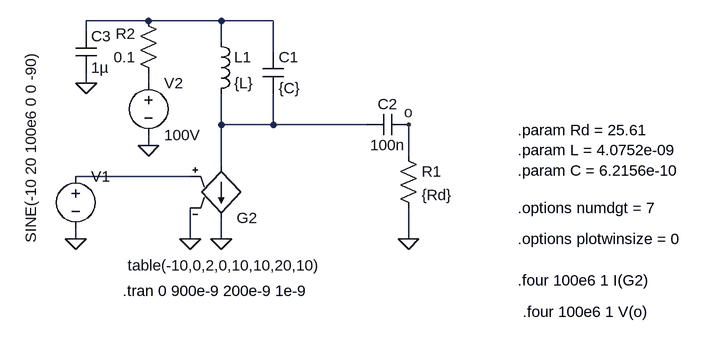
[diagram p0: schematic eje_clase_c_AM.asc]
eje_clase_c_AM.asc, the LTspice schematic file:
Version 4
SHEET 1 880 680
WIRE -256 -96 -352 -96
WIRE -144 -96 -256 -96
WIRE -64 -96 -144 -96
WIRE -352 -80 -352 -96
WIRE -144 -64 -144 -96
WIRE -64 -48 -64 -96
WIRE -352 0 -352 -16
WIRE -256 0 -256 -16
WIRE -144 64 -144 16
WIRE -64 64 -64 16
WIRE -64 64 -144 64
WIRE 80 64 -64 64
WIRE -256 96 -256 80
WIRE 144 112 144 64
WIRE -144 128 -144 64
WIRE -192 144 -368 144
WIRE -368 240 -368 224
WIRE -192 240 -192 192
WIRE -144 240 -144 208
WIRE 144 240 144 192
FLAG -144 240 0
FLAG 144 240 0
FLAG -192 240 0
FLAG -368 240 0
FLAG -256 96 0
FLAG 144 64 o
FLAG -352 0 0
SYMBOL voltage -368 128 R0
WINDOW 3 -69 118 VLeft 2
WINDOW 123 0 0 Left 2
WINDOW 39 0 0 Left 2
SYMATTR Value SINE(-10 20 100e6 0 0 -90)
SYMATTR InstName V1
SYMBOL ind -160 -80 R0
SYMATTR InstName L1
SYMATTR Value {L}
SYMBOL cap -80 -48 R0
SYMATTR InstName C1
SYMATTR Value {C}
SYMBOL cap 144 48 R90
WINDOW 0 0 32 VBottom 2
WINDOW 3 32 32 VTop 2
SYMATTR InstName C2
SYMATTR Value 100n
SYMBOL voltage -256 -16 R0
WINDOW 123 0 0 Left 2
WINDOW 39 0 0 Left 2
SYMATTR InstName V2
SYMATTR Value 100V
SYMBOL res 128 96 R0
SYMATTR InstName R1
SYMATTR Value {Rd}
SYMBOL g2 -144 224 M180
WINDOW 3 -144 -57 Left 2
SYMATTR Value table(-10,0,2,0,10,10,20,10)
SYMATTR InstName G2
SYMBOL cap -368 -80 R0
SYMATTR InstName C3
SYMATTR Value 1µ
SYMBOL res -240 0 R180
WINDOW 0 36 76 Left 2
WINDOW 3 36 40 Left 2
SYMATTR InstName R2
SYMATTR Value 0.1
TEXT -296 320 Left 2 !.tran 0 900e-9 200e-9 1e-9
TEXT 312 72 Left 2 !.param Rd = 25.61\n.param L = 4.0752e-09\n.param C = 6.2156e-10
TEXT 312 192 Left 2 !.options numdgt = 7
TEXT 312 240 Left 2 !.options plotwinsize = 0
TEXT 312 304 Left 2 !.four 100e6 1 I(G2)
TEXT 320 352 Left 2 !.four 100e6 1 V(o)

The netlist it stands for:
* eje_clase_c_AM.asc
V1 N004 0 SINE(-10 20 100e6 0 0 -90)
L1 N001 N003 {L}
C1 N001 N003 {C}
C2 o N003 100n
V2 N002 0 100V
R1 o 0 {Rd}
G2 N003 0 N004 0 table(-10,0,2,0,10,10,20,10)
C3 N001 0 1µ
R2 N002 N001 0.1
.tran 0 900e-9 200e-9 1e-9
.param Rd = 25.61
.param L = 4.0752e-09
.param C = 6.2156e-10
.options numdgt = 7
.options plotwinsize = 0
.four 100e6 1 I(G2)
.four 100e6 1 V(o)
.backanno
.end